# Altium schematic sheet Solenoid_drivers.SchDoc
size A; SheetNumber: 2; SheetTotal: 3
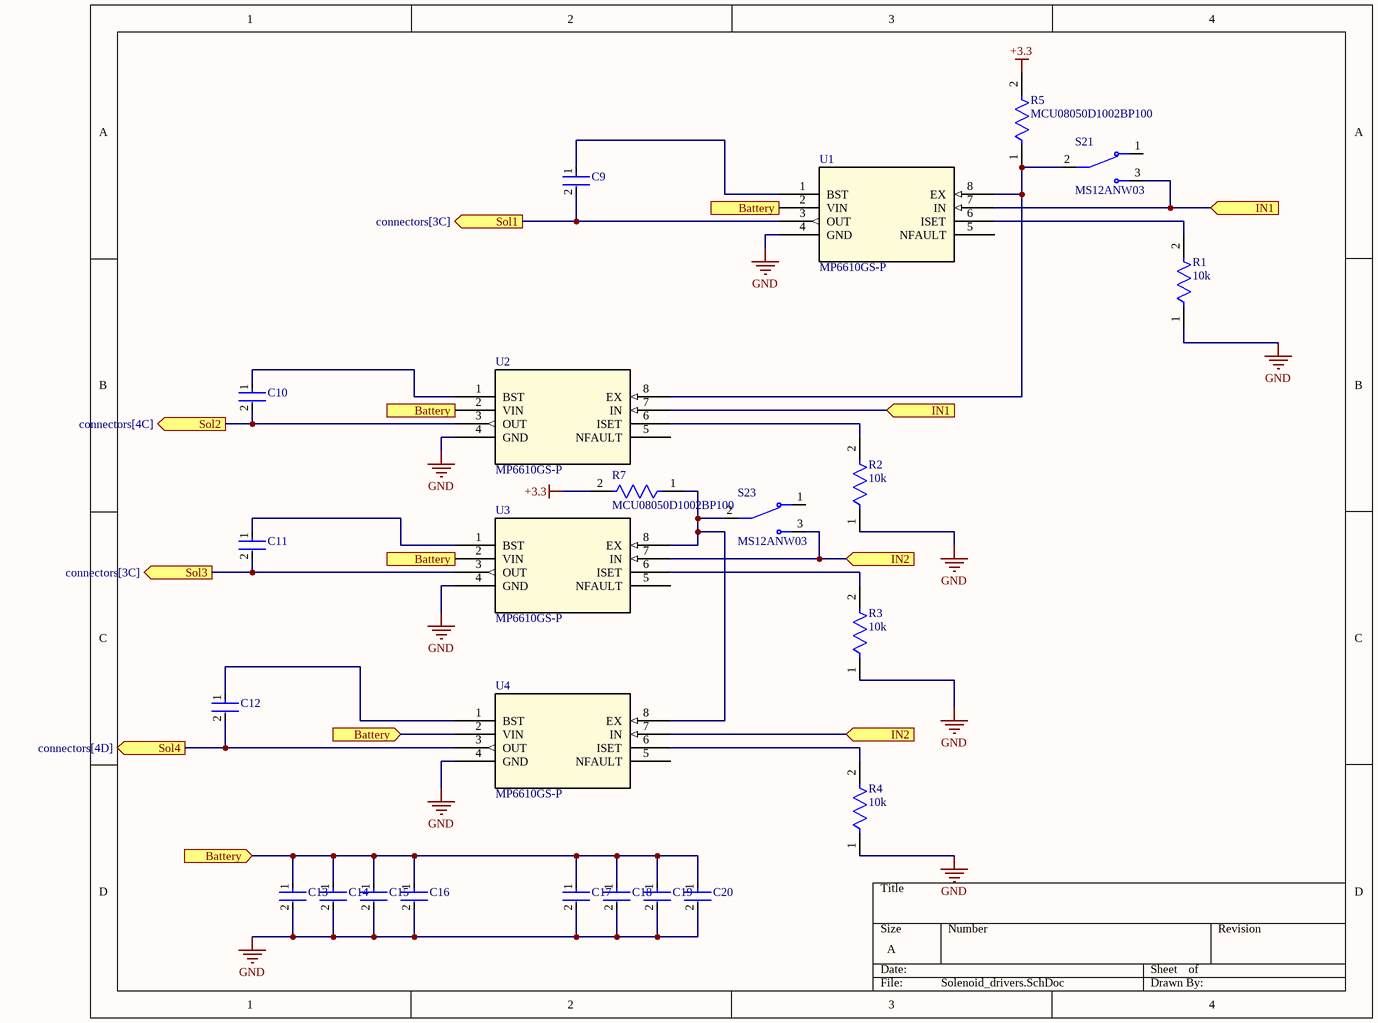
[diagram p0: Solenoid_drivers.SchDoc]

## Parts
C9  C0805C104K5RACTU  [FP-C0805C-DN-MFG]  (value not drawn)
C10  C0805C104K5RACTU  [FP-C0805C-DN-MFG]  (value not drawn)
C11  C0805C104K5RACTU  [FP-C0805C-DN-MFG]  (value not drawn)
C12  C0805C104K5RACTU  [FP-C0805C-DN-MFG]  (value not drawn)
C13  C0805C104K5RACTU  [FP-C0805C-DN-MFG]  (value not drawn)
C14  C0805C104K5RACTU  [FP-C0805C-DN-MFG]  (value not drawn)
C15  C0805C104K5RACTU  [FP-C0805C-DN-MFG]  (value not drawn)
C16  C0805C104K5RACTU  [FP-C0805C-DN-MFG]  (value not drawn)
C17  GRM21BR6YA106ME43L  [FP-GRM21B-0_2-e0_2_0_7-IPC_B]  (value not drawn)
C18  GRM21BR6YA106ME43L  [FP-GRM21B-0_2-e0_2_0_7-IPC_B]  (value not drawn)
C19  GRM21BR6YA106ME43L  [FP-GRM21B-0_2-e0_2_0_7-IPC_B]  (value not drawn)
C20  GRM21BR6YA106ME43L  [FP-GRM21B-0_2-e0_2_0_7-IPC_B]  (value not drawn)
R1  10k  [FP-MCU0805-IPC_C]
R2  10k  [FP-MCU0805-IPC_C]
R3  10k  [FP-MCU0805-IPC_C]
R4  10k  [FP-MCU0805-IPC_C]
R5  MCU08050D1002BP100  [FP-MCU0805-IPC_C]
R7  MCU08050D1002BP100  [FP-MCU0805-IPC_C]
S21  MS12ANW03  [SW_MS12ANW03]
S23  MS12ANW03  [SW_MS12ANW03]
U1  MP6610GS-P  [SOIC-8_MP6610_MNP]
U2  MP6610GS-P  [SOIC-8_MP6610_MNP]
U3  MP6610GS-P  [SOIC-8_MP6610_MNP]
U4  MP6610GS-P  [SOIC-8_MP6610_MNP]

## Ports
Battery (in, see connectors[2B], connectors[3A], PandMshem[1A], PandMshem[3B], Solenoid_drivers[1B], Solenoid_drivers[1C], Solenoid_drivers[1D]), Battery (in, see connectors[2B], connectors[3A], PandMshem[1A], PandMshem[3B], Solenoid_drivers[1B], Solenoid_drivers[1C], Solenoid_drivers[1D], Solenoid_drivers[2A]), Battery (in, see connectors[2B], connectors[3A], PandMshem[1A], PandMshem[3B], Solenoid_drivers[1B], Solenoid_drivers[1C], Solenoid_drivers[2A]), Battery (in, see connectors[2B], connectors[3A], PandMshem[1A], PandMshem[3B], Solenoid_drivers[1C], Solenoid_drivers[1D], Solenoid_drivers[2A]), IN1 (in, see connectors[1A], Solenoid_drivers[3B]), IN1 (in, see connectors[1A], Solenoid_drivers[4A]), IN2 (in, see connectors[1A], Solenoid_drivers[3C]), Sol1 (out, see connectors[3C]), Sol2 (out, see connectors[4C]), Sol3 (out, see connectors[3C]), Sol4 (out, see connectors[4D])

## Nets
+3.3: R5.2 R7.2
GND: C13.2 C14.2 C15.2 C16.2 C17.2 C18.2 C19.2 C20.2 R1.1 R2.1 R3.1 R4.1 U1.4(GND) U2.4(GND) U3.4(GND) U4.4(GND)
Battery: C13.1 C14.1 C15.1 C16.1 C17.1 C18.1 C19.1 C20.1 U1.2(VIN) U2.2(VIN) U3.2(VIN) U4.2(VIN) ; port Battery
IN1: S21.3 U1.7(IN) U2.7(IN) ; port IN1
IN2: S23.3 U3.7(IN) U4.7(IN) ; port IN2
Sol1: C9.2 U1.3(OUT) ; port Sol1
Sol2: C10.2 U2.3(OUT) ; port Sol2
Sol3: C11.2 U3.3(OUT) ; port Sol3
Sol4: C12.2 U4.3(OUT) ; port Sol4
NetC9_1: C9.1 U1.1(BST)
NetC10_1: C10.1 U2.1(BST)
NetC11_1: C11.1 U3.1(BST)
NetC12_1: C12.1 U4.1(BST)
NetR1_2: R1.2 U1.6(ISET)
NetR2_2: R2.2 U2.6(ISET)
NetR3_2: R3.2 U3.6(ISET)
NetR4_2: R4.2 U4.6(ISET)
NetR5_1: R5.1 S21.2 U1.8(EX) U2.8(EX)
NetR7_1: R7.1 S23.2 U3.8(EX) U4.8(EX)

Not connected (* = marked no-connect by the designer): S21 1; S23 1; U1 5(NFAULT); U2 5(NFAULT); U3 5(NFAULT); U4 5(NFAULT)

## Library data of the parts
C9-C11 C13-C16 = CMP-2007-00279-2: CAP CER 0.1UF 50V X7R 0805; Manufacturer: KEMET; Value: 0.10 μF; Tolerance: 0.1; Temperature Coefficient: 30ppm/°C; Material: Ceramic; Manufacturer Part Number: C0805C104K5RACTU; Device Class L2: Capacitors; Temperature Range Low: -55°C; Voltage Rating: 50 V; Digikey Description: CAP CER 0.1UF 50V X7R 0805; Category: Cap; ComponentLink2Description: Datasheet; Octopart: https://octopart.com/c0805c104k5ractu-kemet-143926; RoHS: TRUE; ComponentLink2URL: https://content.kemet.com/datasheets/KEM_C1003_C0G_SMD.pdf; Temperature Characteristic: X7R; Temperature: -55°C to +125°C; Height: 0.88mm; Temperature Range High: +125°C; Device Class L1: Passive Components; Automotive: No; Lead Free: Yes; Ipc Land Pattern Name: CAPC200125X78; Device Class L3: Ceramic Capacitors; Mouser Description: Cap Ceramic 0.1uF 50V X7R 10% SMD 2.0 x 1.2 mm 125 C Paper T/R; Capacitance: 0.10 μF; Package: C0805C-DN
C12 = CMP-2007-00279-2: CAP CER 0.1UF 50V X7R 0805 C0805C104K5RACTU; Manufacturer: KEMET; Value: 0.10 μF; Tolerance: 0.1; Temperature Coefficient: 30ppm/°C; Material: Ceramic; Manufacturer Part Number: C0805C104K5RACTU; Device Class L2: Capacitors; Temperature Range Low: -55°C; Voltage Rating: 50 V; Digikey Description: CAP CER 0.1UF 50V X7R 0805; Category: Cap; ComponentLink2Description: Datasheet; Octopart: https://octopart.com/c0805c104k5ractu-kemet-143926; RoHS: TRUE; ComponentLink2URL: https://content.kemet.com/datasheets/KEM_C1003_C0G_SMD.pdf; Temperature Characteristic: X7R; Temperature: -55°C to +125°C; Height: 0.88mm; Temperature Range High: +125°C; Device Class L1: Passive Components; Automotive: No; Lead Free: Yes; Ipc Land Pattern Name: CAPC200125X78; Device Class L3: Ceramic Capacitors; Mouser Description: Cap Ceramic 0.1uF 50V X7R 10% SMD 2.0 x 1.2 mm 125 C Paper T/R; Capacitance: 0.10 μF; Package: C0805C-DN
C17-C20 = CMP-06035-010759-1: Chip Multilayer Ceramic Capacitors for General Purpose, 0805, 10uF, X5R, 15%, 20%, 35V; Length: 0.079inch; Packaging: Tape and Reel; Weight: 0.000335oz; Height: 1.25mm; Max Operating Temperature: 85°C; Thickness: 0.057inch; Case Code (Metric): 2012; Voltage Rating: 35V; Voltage Rating (DC): 35V; Mount: Surface Mount; Case Code (Imperial): 0805; Width: 0.049inch; Package Quantity: 3000; Tolerance: 20%; Capacitance: 10uF; Min Operating Temperature: -55°C; Case/Package: 0805; Termination: SMD/SMT; Dielectric: X5R
R1-R4 = CMP-02407-010458-1: RES 1.05K OHM 0.5% 1/5W 0805   MCU08050D1002BP100; Power Rating: 125mW; Voltage Rating (DC): 100V; Tolerance: 0.1%; Resistance: 10kR; Temperature Coefficient: 25ppm/°C; Min Operating Temperature: -55°C; Military Standard: Not; Composition: Thin Film; Max Power Dissipation: 125mW; Lead Free: Lead Free; Case/Package: 0805; Contact Plating: Tin; Depth: 1.25mm; Number of Terminations: 2; Height: 0.022inch; Package Quantity: 1000; Max Operating Temperature: 125°C; Packaging: Tape and Reel; Mount: Surface Mount; Radiation Hardening: No; Length: 2mm; Width: 0.049inch
R5 R7 = CMP-02407-010458-1: RES 1.05K OHM 0.5% 1/5W 0805; Power Rating: 125mW; Voltage Rating (DC): 100V; Tolerance: 0.1%; Resistance: 10kR; Temperature Coefficient: 25ppm/°C; Min Operating Temperature: -55°C; Military Standard: Not; Composition: Thin Film; Max Power Dissipation: 125mW; Lead Free: Lead Free; Case/Package: 0805; Contact Plating: Tin; Depth: 1.25mm; Number of Terminations: 2; Height: 0.022inch; Package Quantity: 1000; Max Operating Temperature: 125°C; Packaging: Tape and Reel; Mount: Surface Mount; Radiation Hardening: No; Length: 2mm; Width: 0.049inch
S21 S23 = MS12ANW03: Slide Switch SPDT Through Hole; MF: NKK Switches; Package: None; MP: MS12ANW03; Value: *; Availability: Unavailable; SnapEDA_Link: https://www.snapeda.com/parts/MS12ANW03/NKK%20Switches/view-part/489520/?ref=snap; Price: None
U1-U4 = MP6610GS-P: No Description Available; Mfr_Name: Monolithic Power Systems; RefDes: RefDes; Type: Type